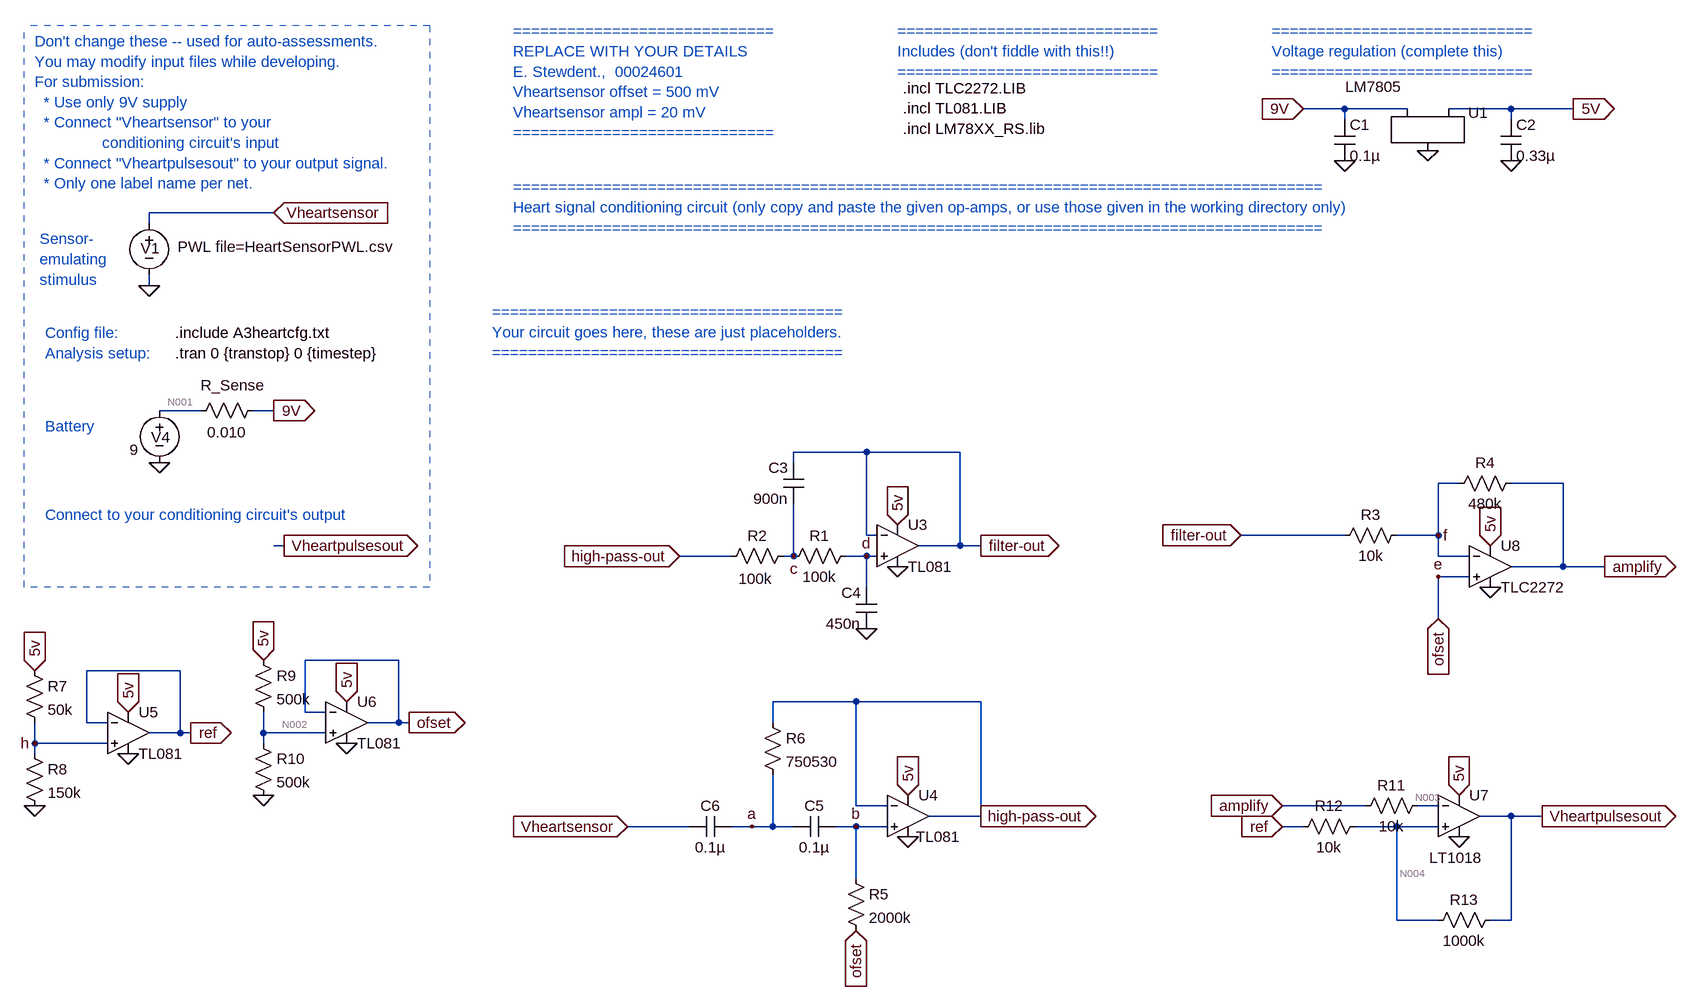
[diagram p0: schematic E344_A3_heart.asc]
E344_A3_heart.asc, the LTspice schematic file:
Version 4
SHEET 1 1824 680
WIRE -272 -1280 -336 -1280
WIRE -176 -1280 -272 -1280
WIRE -16 -1280 -112 -1280
WIRE 80 -1280 -16 -1280
WIRE -272 -1264 -272 -1280
WIRE -16 -1264 -16 -1280
WIRE -1920 -1120 -2112 -1120
WIRE -2112 -1104 -2112 -1120
WIRE -2112 -1008 -2112 -1024
WIRE -2032 -816 -2096 -816
WIRE -1920 -816 -1952 -816
WIRE -1008 -752 -1120 -752
WIRE -864 -752 -1008 -752
WIRE -1120 -736 -1120 -752
WIRE -96 -704 -128 -704
WIRE 64 -704 -16 -704
WIRE -1008 -624 -1008 -752
WIRE -992 -624 -1008 -624
WIRE -272 -624 -432 -624
WIRE -128 -624 -128 -704
WIRE -128 -624 -192 -624
WIRE -1904 -608 -1920 -608
WIRE -864 -608 -864 -752
WIRE -864 -608 -928 -608
WIRE -832 -608 -864 -608
WIRE -1216 -592 -1296 -592
WIRE -1120 -592 -1120 -672
WIRE -1120 -592 -1136 -592
WIRE -1008 -592 -1040 -592
WIRE -992 -592 -1008 -592
WIRE -128 -592 -128 -624
WIRE -80 -592 -128 -592
WIRE 64 -576 64 -704
WIRE 64 -576 -16 -576
WIRE 128 -576 64 -576
WIRE -80 -560 -128 -560
WIRE -1008 -544 -1008 -592
WIRE -128 -496 -128 -560
WIRE -1728 -432 -1872 -432
WIRE -2064 -416 -2208 -416
WIRE -1024 -368 -1152 -368
WIRE -832 -368 -1024 -368
WIRE -1872 -352 -1872 -432
WIRE -1840 -352 -1872 -352
WIRE -2208 -336 -2208 -416
WIRE -2176 -336 -2208 -336
WIRE -1728 -336 -1728 -432
WIRE -1728 -336 -1776 -336
WIRE -1712 -336 -1728 -336
WIRE -1152 -336 -1152 -368
WIRE -2064 -320 -2064 -416
WIRE -2064 -320 -2112 -320
WIRE -2048 -320 -2064 -320
WIRE -1936 -320 -1936 -352
WIRE -1840 -320 -1936 -320
WIRE -2288 -304 -2288 -336
WIRE -2176 -304 -2288 -304
WIRE -1936 -304 -1936 -320
WIRE -2288 -288 -2288 -304
WIRE -1024 -208 -1024 -368
WIRE -976 -208 -1024 -208
WIRE -240 -208 -368 -208
WIRE -128 -208 -160 -208
WIRE -832 -192 -832 -368
WIRE -832 -192 -912 -192
WIRE -16 -192 -64 -192
WIRE 32 -192 -16 -192
WIRE -1280 -176 -1376 -176
WIRE -1184 -176 -1216 -176
WIRE -1152 -176 -1152 -256
WIRE -1152 -176 -1184 -176
WIRE -1120 -176 -1152 -176
WIRE -1024 -176 -1056 -176
WIRE -976 -176 -1024 -176
WIRE -336 -176 -368 -176
WIRE -192 -176 -256 -176
WIRE -128 -176 -192 -176
WIRE -1024 -96 -1024 -176
WIRE -192 -32 -192 -176
WIRE -128 -32 -192 -32
WIRE -16 -32 -16 -192
WIRE -16 -32 -48 -32
FLAG -2112 -1008 0
FLAG -1920 -1120 Vheartsensor
IOPIN -1920 -1120 In
FLAG -1920 -816 9V
IOPIN -1920 -816 Out
FLAG -2096 -736 0
FLAG -336 -1280 9V
IOPIN -336 -1280 In
FLAG -144 -1216 0
FLAG 80 -1280 5V
IOPIN 80 -1280 Out
FLAG -1904 -608 Vheartpulsesout
IOPIN -1904 -608 Out
FLAG -1376 -176 Vheartsensor
IOPIN -1376 -176 In
FLAG 32 -192 Vheartpulsesout
IOPIN 32 -192 Out
FLAG -960 -576 0
FLAG -960 -640 5v
IOPIN -960 -640 In
FLAG -1008 -480 0
FLAG -432 -624 filter-out
IOPIN -432 -624 In
FLAG -48 -544 0
FLAG -48 -608 5v
IOPIN -48 -608 In
FLAG -832 -608 filter-out
IOPIN -832 -608 Out
FLAG -944 -224 5v
IOPIN -944 -224 In
FLAG -944 -160 0
FLAG -832 -192 high-pass-out
IOPIN -832 -192 Out
FLAG -1296 -592 high-pass-out
IOPIN -1296 -592 In
FLAG -1024 -16 ofset
IOPIN -1024 -16 In
FLAG -128 -496 ofset
IOPIN -128 -496 In
FLAG 128 -576 amplify
IOPIN 128 -576 Out
FLAG -2288 -416 5v
IOPIN -2288 -416 In
FLAG -2288 -208 0
FLAG -2048 -320 ref
IOPIN -2048 -320 Out
FLAG -2144 -288 0
FLAG -2144 -352 5v
IOPIN -2144 -352 In
FLAG -1184 -176 a
FLAG -1024 -176 b
FLAG -1120 -592 c
FLAG -1008 -592 d
FLAG -128 -560 e
FLAG -128 -624 f
FLAG -2288 -304 h
FLAG -1936 -432 5v
IOPIN -1936 -432 In
FLAG -1936 -224 0
FLAG -1712 -336 ofset
IOPIN -1712 -336 Out
FLAG -1808 -304 0
FLAG -1808 -368 5v
IOPIN -1808 -368 In
FLAG -96 -160 0
FLAG -96 -224 5v
IOPIN -96 -224 In
FLAG -368 -208 amplify
IOPIN -368 -208 In
FLAG -368 -176 ref
IOPIN -368 -176 In
FLAG -272 -1200 0
FLAG -16 -1200 0
SYMBOL voltage -2112 -1120 R0
WINDOW 123 0 0 Left 0
WINDOW 39 0 0 Left 0
WINDOW 3 44 52 Left 2
WINDOW 0 -13 54 Left 2
SYMATTR Value PWL file=HeartSensorPWL.csv
SYMATTR InstName V1
SYMBOL voltage -2096 -832 R0
WINDOW 123 24 44 Left 2
WINDOW 39 0 0 Left 0
WINDOW 3 -46 76 Left 2
WINDOW 0 -13 57 Left 2
SYMATTR Value 9
SYMATTR InstName V4
SYMBOL res -1936 -832 R90
WINDOW 0 -7 47 VBottom 2
WINDOW 3 34 56 VTop 2
SYMATTR InstName R_Sense
SYMATTR Value 0.010
SYMBOL LM7805 -144 -1264 R0
WINDOW 3 -83 -66 Top 2
SYMATTR InstName U1
SYMBOL res -1024 -608 R90
WINDOW 0 0 56 VBottom 2
WINDOW 3 32 56 VTop 2
SYMATTR InstName R1
SYMATTR Value 100k
SYMBOL res -1120 -608 R90
WINDOW 0 0 56 VBottom 2
WINDOW 3 35 59 VTop 2
SYMATTR InstName R2
SYMATTR Value 100k
SYMBOL cap -1104 -672 R180
WINDOW 0 24 56 Left 2
WINDOW 3 24 8 Left 2
SYMATTR InstName C3
SYMATTR Value 900n
SYMBOL cap -992 -480 R180
WINDOW 0 24 56 Left 2
WINDOW 3 24 8 Left 2
SYMATTR InstName C4
SYMATTR Value 450n
SYMBOL Opamps\\opamp2 -960 -672 R0
SYMATTR InstName U3
SYMATTR Value TL081
SYMBOL res -176 -640 R90
WINDOW 0 0 56 VBottom 2
WINDOW 3 32 56 VTop 2
SYMATTR InstName R3
SYMATTR Value 10k
SYMBOL res 0 -720 R90
WINDOW 0 0 56 VBottom 2
WINDOW 3 32 56 VTop 2
SYMATTR InstName R4
SYMATTR Value 480k
SYMBOL Opamps\\opamp2 -944 -256 R0
WINDOW 3 12 96 Left 2
SYMATTR Value TL081
SYMATTR InstName U4
SYMBOL res -1040 -112 R0
SYMATTR InstName R5
SYMATTR Value 2000k
SYMBOL res -1168 -352 R0
SYMATTR InstName R6
SYMATTR Value 750530
SYMBOL cap -1056 -192 R90
WINDOW 0 0 32 VBottom 2
WINDOW 3 32 32 VTop 2
SYMATTR InstName C5
SYMATTR Value 0.1µ
SYMBOL cap -1216 -192 R90
WINDOW 0 0 32 VBottom 2
WINDOW 3 32 32 VTop 2
SYMATTR InstName C6
SYMATTR Value 0.1µ
SYMBOL res -2304 -432 R0
SYMATTR InstName R7
SYMATTR Value 50k
SYMBOL res -2304 -304 R0
SYMATTR InstName R8
SYMATTR Value 150k
SYMBOL Opamps\\opamp2 -2144 -384 R0
SYMATTR InstName U5
SYMATTR Value TL081
SYMBOL res -1952 -448 R0
SYMATTR InstName R9
SYMATTR Value 500k
SYMBOL res -1952 -320 R0
SYMATTR InstName R10
SYMATTR Value 500k
SYMBOL Opamps\\opamp2 -1808 -400 R0
SYMATTR InstName U6
SYMATTR Value TL081
SYMBOL res -144 -224 R90
WINDOW 0 0 56 VBottom 2
WINDOW 3 32 56 VTop 2
SYMATTR InstName R11
SYMATTR Value 10k
SYMBOL res -240 -192 R90
WINDOW 0 0 56 VBottom 2
WINDOW 3 32 56 VTop 2
SYMATTR InstName R12
SYMATTR Value 10k
SYMBOL res -32 -48 R90
WINDOW 0 0 56 VBottom 2
WINDOW 3 32 56 VTop 2
SYMATTR InstName R13
SYMATTR Value 1000k
SYMBOL Comparators\\LT1018 -96 -192 R0
WINDOW 3 -46 64 Left 2
SYMATTR InstName U7
SYMBOL Opamps\\opamp2 -48 -640 R0
SYMATTR InstName U8
SYMATTR Value TLC2272
SYMBOL cap -288 -1264 R0
SYMATTR InstName C1
SYMATTR Value 0.1µ
SYMBOL cap -32 -1264 R0
SYMATTR InstName C2
SYMATTR Value 0.33µ
TEXT -2072 -904 Left 2 !.tran 0 {transtop} 0 {timestep}
TEXT -2072 -936 Left 2 !.include A3heartcfg.txt
TEXT -2288 -1384 Left 2 ;Don't change these -- used for auto-assessments.\nYou may modify input files while developing.\nFor submission: \n  * Use only 9V supply \n  * Connect "Vheartsensor" to your \n               conditioning circuit's input\n  * Connect "Vheartpulsesout" to your output signal.\n  * Only one label name per net.
TEXT -2272 -936 Left 2 ;Config file:
TEXT -2272 -904 Left 2 ;Analysis setup:
TEXT -2272 -792 Left 2 ;Battery
TEXT -2280 -1080 Left 2 ;Sensor-\nemulating \nstimulus
TEXT -1552 -1400 Left 2 ;=============================\nREPLACE WITH YOUR DETAILS\nE. Stewdent.,  00024601\nVheartsensor offset = 500 mV\nVheartsensor ampl = 20 mV\n=============================
TEXT -1552 -1160 Left 2 ;==========================================================================================\nHeart signal conditioning circuit (only copy and paste the given op-amps, or use those given in the working directory only)\n==========================================================================================
TEXT -384 -1400 Left 2 ;=============================\nVoltage regulation (complete this)\n=============================
TEXT -952 -1312 Left 2 !.incl TLC2272.LIB\n.incl TL081.LIB\n.incl LM78XX_RS.lib
TEXT -2272 -656 Left 2 ;Connect to your conditioning circuit's output
TEXT -960 -1400 Left 2 ;=============================\nIncludes (don't fiddle with this!!)\n=============================
TEXT -1584 -968 Left 2 ;=======================================\nYour circuit goes here, these are just placeholders.\n=======================================
LINE Normal -2304 -544 -2304 -1408 1
LINE Normal -1680 -1408 -1680 -544 1
LINE Normal -1680 -544 -2304 -544 1
LINE Normal -1680 -1408 -2304 -1408 1

The netlist it stands for:
* E344_A3_heart.asc
V1 Vheartsensor 0 PWL file=HeartSensorPWL.csv
V4 N001 0 9
R_Sense 9V N001 0.010
XU1 9V 0 5V LM7805
R1 d c 100k
R2 c high-pass-out 100k
C3 c filter-out 900n
C4 0 d 450n
XU3 d filter-out 5V 0 filter-out TL081  ; pins In+ In- V+ V- OUT
R3 f filter-out 10k
R4 amplify f 480k
XU4 b high-pass-out 5V 0 high-pass-out TL081  ; pins In+ In- V+ V- OUT
R5 b e 2000k
R6 high-pass-out a 750530
C5 b a 0.1µ
C6 a Vheartsensor 0.1µ
R7 5V h 50k
R8 h 0 150k
XU5 h ref 5V 0 ref TL081  ; pins In+ In- V+ V- OUT
R9 5V N002 500k
R10 N002 0 500k
XU6 N002 e 5V 0 e TL081  ; pins In+ In- V+ V- OUT
R11 N003 amplify 10k
R12 N004 ref 10k
R13 Vheartpulsesout N004 1000k
XU7 N004 N003 5V 0 Vheartpulsesout LT1018  ; pins In+ In- V+ V- OUT
XU8 e f 5V 0 amplify TLC2272  ; pins In+ In- V+ V- OUT
C1 9V 0 0.1µ
C2 5V 0 0.33µ
.tran 0 {transtop} 0 {timestep}
.include A3heartcfg.txt
* Don't change these -- used for auto-assessments.
* You may modify input files while developing.
* For submission:
*   * Use only 9V supply
*   * Connect "Vheartsensor" to your
*                conditioning circuit's input
*   * Connect "Vheartpulsesout" to your output signal.
*   * Only one label name per net.
* Config file:
* Analysis setup:
* Battery
* Sensor-
* emulating
* stimulus
* =============================
* REPLACE WITH YOUR DETAILS
* E. Stewdent.,  00024601
* Vheartsensor offset = 500 mV
* Vheartsensor ampl = 20 mV
* =============================
* ==========================================================================================
* Heart signal conditioning circuit (only copy and paste the given op-amps, or use those given in the working directory only)
* ==========================================================================================
* =============================
* Voltage regulation (complete this)
* =============================
.incl TLC2272.LIB
.incl TL081.LIB
.incl LM78XX_RS.lib
* Connect to your conditioning circuit's output
* =============================
* Includes (don't fiddle with this!!)
* =============================
* =======================================
* Your circuit goes here, these are just placeholders.
* =======================================
.lib LTC1.lib
.backanno
.end

* Results of the author's LTspice run, read from the files saved beside the schematic
* Operating Point, zero values left out:
*   V(vheartsensor) = 1.198 V
*   V(n001) = 9 V
*   V(9v) = 9 V
*   V(5v) = 5.003 V
*   V(d) = 2.501 V
*   V(c) = 2.501 V
*   V(high-pass-out) = 2.501 V
*   V(filter-out) = 2.501 V
*   V(f) = 2.502 V
*   V(amplify) = 2.522 V
*   V(b) = 2.501 V
*   V(e) = 2.501 V
*   V(a) = 2.501 V
*   V(h) = 3.752 V
*   V(ref) = 3.46 V
*   V(n002) = 2.501 V
*   V(n003) = 2.522 V
*   V(n004) = 3.475 V
*   V(vheartpulsesout) = 4.962 V
*   I(C6) = -9.817 pA
*   I(C5) = -18 pA
*   I(C4) = 113.4 pA
*   I(C3) = -77.07 pA
*   I(R13) = 1.487 µA
*   I(R12) = 1.481 µA
*   I(R11) = -100 pA
*   I(R10) = 5.003 µA
*   I(R9) = 5.003 µA
*   I(R8) = 25.01 µA
*   I(R7) = 25.01 µA
*   I(R6) = 8.184 pA
*   I(R5) = -14.55 pA
*   I(R4) = 41.48 nA
*   I(R3) = 41.48 nA
*   I(R2) = 157.9 pA
*   I(R1) = 80.87 pA
*   I(R_sense) = -17.66 mA
*   I(V4) = -17.66 mA
*   I(V1) = -9.817 pA
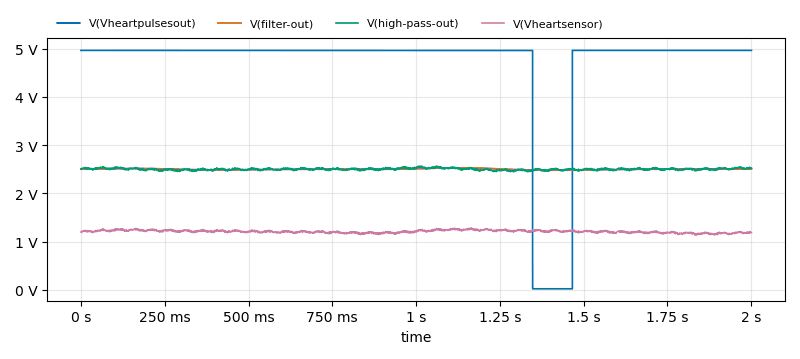
[diagram p1: Transient Analysis of E344_A3_heart.asc, plotted from the saved traces]
* Transient Analysis, 1 run:
*   V(Vheartpulsesout): min 22.32 mV, max 4.962 V, average 4.669 V, rms 4.812 V, last 4.962 V
*   V(filter-out): min 2.478 V, max 2.529 V, average 2.501 V, rms 2.501 V, last 2.509 V
*   V(high-pass-out): min 2.445 V, max 2.566 V, average 2.501 V, rms 2.501 V, last 2.521 V
*   V(Vheartsensor): min 1.138 V, max 1.282 V, average 1.209 V, rms 1.209 V, last 1.188 V